# Altium schematic sheet ADC_Input_protection.SchDoc
size A4; SheetNumber: 9; SheetTotal: 10
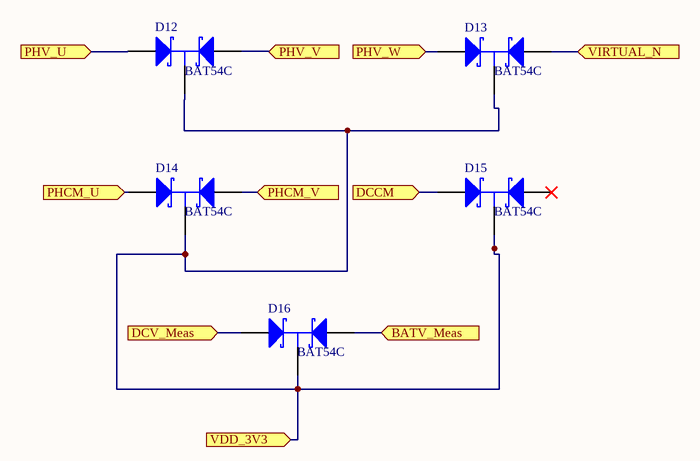
[diagram p0: ADC_Input_protection.SchDoc]

## Parts
D12  BAT54C  [NXP-SOT23-3_V]
D13  BAT54C  [NXP-SOT23-3_V]
D14  BAT54C  [NXP-SOT23-3_V]
D15  BAT54C  [NXP-SOT23-3_V]
D16  BAT54C  [NXP-SOT23-3_V]

## Ports
BATV_Meas (in, see DC_Current_Voltage_Measurement[2C], MCU[3C]), DCCM (in, see DC_Current_Voltage_Measurement[3A], MCU[3B]), DCV_Meas (in, see DC_Current_Voltage_Measurement[3D], MCU[3C]), PHCM_U (in, see MCU[3B], MotorDrivers[1C]), PHCM_V (in, see MCU[3B], MotorDrivers[1C]), PHV_U (in, see MCU[3C], PhaseVoltage[1A], ZeroCrossing[2B]), PHV_V (in, see MCU[3B], PhaseVoltage[1A], ZeroCrossing[2B]), PHV_W (in, see MCU[3C], PhaseVoltage[2A], ZeroCrossing[2C]), VDD_3V3 (in, see DC-DC_Buck_Converter+12Vto+3.3V[3C], DC_Current_Voltage_Measurement[3B], MCU[1B], MotorDrivers[1A], MotorDrivers[1B], Power[2C], ZeroCrossing[1A]), VIRTUAL_N (in, see MCU[3C], PhaseVoltage[1A], ZeroCrossing[1B])

## Nets
BATV_Meas: D16.1(A) ; port BATV_Meas
DCCM: D15.2(A) ; port DCCM
DCV_Meas: D16.2(A) ; port DCV_Meas
PHCM_U: D14.2(A) ; port PHCM_U
PHCM_V: D14.1(A) ; port PHCM_V
PHV_U: D12.2(A) ; port PHV_U
PHV_V: D12.1(A) ; port PHV_V
PHV_W: D13.2(A) ; port PHV_W
VDD_3V3: D12.3(K) D13.3(K) D14.3(K) D15.3(K) D16.3(K) ; port VDD_3V3
VIRTUAL_N: D13.1(A) ; port VIRTUAL_N

Not connected (* = marked no-connect by the designer): D15 1(A)*

## Library data of the parts
D12-D16 = CMP-0417-00003-1: Schottky Barrier Diode, 30 V, 2 uA, -55 to 150 degC, 3-Pin SOT23, RoHS, Tape and Reel; Manufacturer: NXP Semiconductors; IR (uA): 2; VF (mV): 800; Trr (ns): 5; Cd (pF): 10; VR (V): 30; Rth(j-a) (K/W): 500; RoHS: TRUE; Packing: Tape and Reel; ComponentLink2URL: http://www.nxp.com/documents/data_sheet/BAT54_SER.pdf; PartNumber: BAT54C; ComponentLink2Description: Datasheet; Temperature Range: -55 to 150 degC; PackageReference: SOT23-3; PackageDescription: 3-Pin Plastic Surface-mounted Package, Body 1.3 x 2.9 mm, Pitch 0.95 mm; Mounting Technology: Surface Mount; ComponentLink1URL: http://www.nxp.com/; DatasheetVersion: Rev. 5; ComponentLink1Description: Manufacturer URL